# EAGLE design LED_I2C_Plug-Miller (EAGLE 9.6.2)
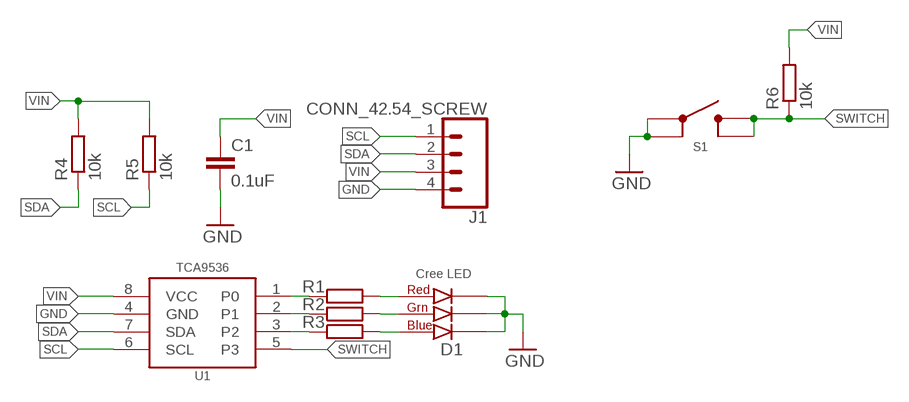
[diagram p0: schematic, sheet 1]

## Parts
C1  0.1uF  C-EU0.1UFC0603  [C0603]
D1  CLX6F-FKC  [CLX6F-FKC]
J1  CONN_42.54_SCREW  [1X04_SCREW]
R1  R-EU_330R0603  [R0603]
R2  R-EU_330R0603  [R0603]
R3  R-EU_330R0603  [R0603]
R4  10k  R-EU_10KR0603  [R0603]
R5  10k  R-EU_10KR0603  [R0603]
R6  10k  R-EU_10KR0603  [R0603]
S1  BUTTON4.2X3.2  [SWITCH_4.2X3.2]
U1  PCA9536VSSOP  [DGK_S-PDSO-G8]

## Nets
GND: C1.2 D1.P$1 D1.P$2 D1.P$3 J1.4 S1.1 S1.2 U1.4(GND)
N$1: D1.P$4 R1.2
N$2: D1.P$5 R2.2
N$3: D1.P$6 R3.2
N$4: R3.1 U1.3(P2)
N$5: R2.1 U1.2(P1)
N$6: R1.1 U1.1(P0)
SCL: J1.1 R5.1 U1.6(SCL)
SDA: J1.2 R4.1 U1.7(SDA)
SWITCH: R6.1 S1.3 S1.4 U1.5(P3)
VIN: C1.1 J1.3 R4.2 R5.2 R6.2 U1.8(VCC)

## Library data of the parts
C1 = bschulz_passives:C-EU: CAPACITOR, European symbol; DIGIKEY: 490-6051-1-ND; MF: Murata; MPN: GCM188R71E104KA57D
D1 = bschulz:CLX6F-FKC: Cree RBG LED, PLCC6 Package (Small Layout)
J1 = bschulz:CONN_4: Genaric 4 terminal header Digikey 2.54_SCREW <https://www.digikey.com/product-detail/en/on-shore-technology-inc/OSTVN04A150/ED10563-ND/1588864>; DIGIKEY: ED10563-ND; MF: On Shore; MPN: OSTVN04A150
R1-R3 = bschulz_passives:R-EU_: RESISTOR, European symbol Digikey Parts: Yageo, 0402 <https://www.digikey.com/products/en/resistors/chip-resistor-surface-mount/52?k=&pkeyword=&sv=0&s=4356&sf=1&FV=-1%7C13%2C7%7C2%2C1291%7C39157%2C1989%7C0%2C-8%7C52%2C3%7C1131%2C3%7C2503&quantity=&ColumnSort=0&page=1&stock=1&pageSize=25> Yageo, 0603 <https://www.digikey.com/products/en/resistors/chip-resistor-surface-mount/52?k=&pkeyword=&sv=0&pv1291=39245&sf=1&FV=-5%7C4356%2C-5%7C47360%2C-8%7C52%2C-1%7C13%2C7%7C2%2C1989%7C0&quantity=10&ColumnSort=1000011&page=1&stock=1&pageSize=25> Panasonic, 0603 <https://www.digikey.com/products/en/resistors/chip-resistor-surface-mount/52?k=&pkeyword=&pv252=68&sf=0&FV=ffec373d%2C1c0002%2C142c040c%2C1f140000%2Cffe00034%2C80002%2Cc0001&quantity=&ColumnSort=0&page=1&stock=1&pageSize=25> Panasonic, precision, 0603 <https://www.digikey.com/products/en/resistors/chip-resistor-surface-mount/52?FV=ffec4907%2Cfffc000a%2Cc0172%2C142c040c%2C1f140000%2Cffe00034%2C1c0002&quantity=100&ColumnSort=2085&page=1&stock=1&pageSize=25> Panasonic, 0805 <https://www.digikey.com/products/en/resistors/chip-resistor-surface-mount/52?k=&pkeyword=&pv3=1&sf=0&FV=ffec373d%2C1c0002%2C1f140000%2Cffe00034%2C142c040d&quantity=&ColumnSort=0&page=1&stock=1&pageSize=25> Rohm, current sense <https://www.digikey.com/products/en/resistors/chip-resistor-surface-mount/52?k=&pkeyword=&pv3=1&sf=0&FV=ffecb688%2C1f140000%2Cffe00034%2C1c0002&quantity=&ColumnSort=0&page=1&stock=1&pageSize=25> Vishay, pulse proof automotive <https://www.digikey.com/products/en/resistors/chip-resistor-surface-mount/52?k=&pkeyword=&pv7=2&sf=0&FV=ffec5d6b%2Cffe00034%2C1f140000&quantity=&ColumnSort=0&page=1&stock=1&pageSize=25>; DIGIKEY: 311-330HRCT-ND; MF: Yageo; MPN: RC0603FR-07330RL; VALUE_PART: 330
R4-R6 = bschulz_passives:R-EU_: RESISTOR, European symbol Digikey Parts: Yageo, 0402 <https://www.digikey.com/products/en/resistors/chip-resistor-surface-mount/52?k=&pkeyword=&sv=0&s=4356&sf=1&FV=-1%7C13%2C7%7C2%2C1291%7C39157%2C1989%7C0%2C-8%7C52%2C3%7C1131%2C3%7C2503&quantity=&ColumnSort=0&page=1&stock=1&pageSize=25> Yageo, 0603 <https://www.digikey.com/products/en/resistors/chip-resistor-surface-mount/52?k=&pkeyword=&sv=0&pv1291=39245&sf=1&FV=-5%7C4356%2C-5%7C47360%2C-8%7C52%2C-1%7C13%2C7%7C2%2C1989%7C0&quantity=10&ColumnSort=1000011&page=1&stock=1&pageSize=25> Panasonic, 0603 <https://www.digikey.com/products/en/resistors/chip-resistor-surface-mount/52?k=&pkeyword=&pv252=68&sf=0&FV=ffec373d%2C1c0002%2C142c040c%2C1f140000%2Cffe00034%2C80002%2Cc0001&quantity=&ColumnSort=0&page=1&stock=1&pageSize=25> Panasonic, precision, 0603 <https://www.digikey.com/products/en/resistors/chip-resistor-surface-mount/52?FV=ffec4907%2Cfffc000a%2Cc0172%2C142c040c%2C1f140000%2Cffe00034%2C1c0002&quantity=100&ColumnSort=2085&page=1&stock=1&pageSize=25> Panasonic, 0805 <https://www.digikey.com/products/en/resistors/chip-resistor-surface-mount/52?k=&pkeyword=&pv3=1&sf=0&FV=ffec373d%2C1c0002%2C1f140000%2Cffe00034%2C142c040d&quantity=&ColumnSort=0&page=1&stock=1&pageSize=25> Rohm, current sense <https://www.digikey.com/products/en/resistors/chip-resistor-surface-mount/52?k=&pkeyword=&pv3=1&sf=0&FV=ffecb688%2C1f140000%2Cffe00034%2C1c0002&quantity=&ColumnSort=0&page=1&stock=1&pageSize=25> Vishay, pulse proof automotive <https://www.digikey.com/products/en/resistors/chip-resistor-surface-mount/52?k=&pkeyword=&pv7=2&sf=0&FV=ffec5d6b%2Cffe00034%2C1f140000&quantity=&ColumnSort=0&page=1&stock=1&pageSize=25>; DIGIKEY: 311-10.0KHRCT-ND; MF: Yageo; MPN: RC0603FR-0710KL; VALUE_PART: 10k
S1 = bschulz:BUTTON: Genaric SPST Push button; DIGIKEY: CKN10504CT-ND; MF: C&K; MPN: PTS810 SJG 250 SMTR LFS
U1 = bschulz:PCA9536: PCA9536 - I2C I/O Expander, 4 bit, 5V tollerant Characteristics: Vcc: 2.3V ~ 5.5V IOut: >10mA IQ: 1μA Operating Temperature: -40°C to 85°C Internal Pullups Digikey: 296-20952-1-ND (DGK) <https://www.digikey.com/product-detail/en/texas-instruments/PCA9536DGKR/296-20952-1-ND/1216922>; DIGIKEY: 296-20952-1-ND; MF: TI; MPN: PCA9536DGKR

## Board
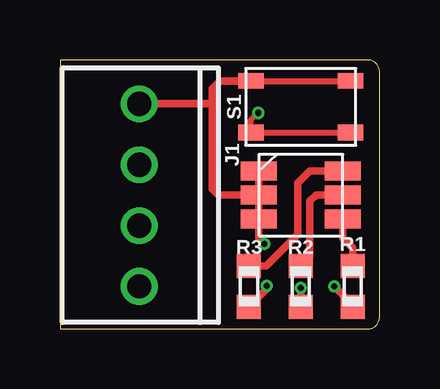
[diagram p1: board, top side]
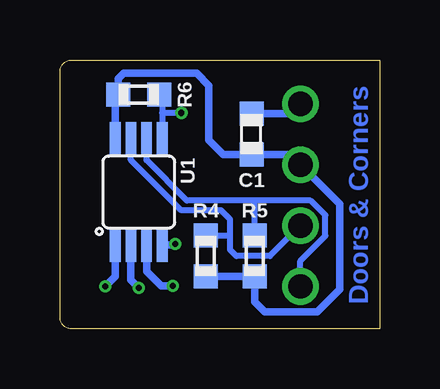
[diagram p2: board, bottom side, seen from below]

Size 13.32 x 11.23 mm. Coordinates in mm from the lower left corner, seen from the top.
Outline: 0,0 12.82,0 arc90 13.32,0.5 13.32,10.73 arc90 12.82,11.23 0,11.23 0,0
Copper layers (1*16): Top 0.035559375mm / dielectric 1.6mm / Bottom 0.035559375mm
Design rules "oshpark-2layer": minimum track width 6mil, minimum drill 10mil, track to track 6mil, track to pad 6mil, pad to pad 6mil, via to via 6mil, smd to smd 6mil, copper to edge 15mil, drill to drill 6mil, minimum pad ring 5mil, minimum via ring 5mil, stop-mask expansion 2.5mil, vias tented up to drill 0mil, thermal gap 10mil

### Footprints (pad centres in the part's own frame; a part is rotated, then mirrored left to right if it is on the bottom)
C0603 = smd 1 x 1: 1 -0.85,0; 2 0.85,0
CLX6F-FKC = smd 1.5 x 0.8: P$1 -1.75,1; P$2 -1.75,0; P$3 -1.75,-1; P$4 1.75,-1; P$5 1.75,0; P$6 1.75,1
1X04_SCREW = drill 1.016: 1 -3.81,0; 2 -1.27,0; 3 1.27,0; 4 3.81,0
R0603 = smd 1 x 1: 1 -0.85,0; 2 0.85,0
SWITCH_4.2X3.2 = smd 1.05 x 0.65: 1 -2.075,1.075; 2 2.075,1.075; 3 -2.075,-1.075; 4 2.075,-1.075
DGK_S-PDSO-G8 = smd 1.45 x 0.45: 1 -2.2,0.975; 2 -2.2,0.325; 3 -2.2,-0.325; 4 -2.2,-0.975; 5 2.2,-0.975; 6 2.2,-0.325; 7 2.2,0.325; 8 2.2,0.975

### Placement (x,y rotation side)
C1  5.33,8.13 90 bottom
D1  10.03,5.59 0 top
J1  3.3,5.59 90 top
R1  12.19,1.78 90 top
R2  10.03,1.78 90 top
R3  7.87,1.78 90 top
R4  7.24,3.05 270 bottom
R5  5.21,3.05 270 bottom
R6  10.03,9.78 180 bottom
S1  10.03,9.27 0 top
U1  10.03,5.71 90 bottom

### Tracks (layer width: path | path; a pad name or v marks a point on that pad's centre or on a via)
GND  (via drill 0.25)
  Top 0.254: S1.1 S1.2
  Top 0.305: D1.P$1 D1.P$2 | D1.P$2 D1.P$3 8.28,3.78 v8.51,3.56 | S1.1 6.66,10.35 6.35,10.03 6.35,9.4 | 6.35,9.4 6.35,5.84 6.6,5.59 D1.P$2 | J1.4 6.35,9.4
  Bottom 0.305: C1.2 3.72,8.98 J1.4 | U1.4 8.51,3.52 v8.51,3.56
N$1
  Top 0.305: R1.2 12.19,3.39 11.78,3.8 D1.P$4
N$2
  Top 0.305: R2.2 10.41,3.01 10.41,5.33 10.67,5.59 D1.P$5
N$3
  Top 0.305: 8.17,2.33 R3.2 8.6,2.63 9.91,3.94 9.91,6.1 10.4,6.59 D1.P$6 11.67,6.59
N$4  (via drill 0.25)
  Top 0.305: v8.62,1.8 8.62,1.67 R3.1
  Bottom 0.305: v8.62,1.8 9.1,1.8 9.71,2.4 U1.3
N$5  (via drill 0.25)
  Top 0.305: v10.03,1.72 R2.1
  Bottom 0.305: U1.2 10.36,2.05 v10.03,1.72
N$6  (via drill 0.25)
  Top 0.305: v11.43,1.78 12.19,1.02 R1.1
  Bottom 0.305: U1.1 11.01,2.2 v11.43,1.78
SCL
  Bottom 0.254: J1.1 3.3,2.85 2.26,3.89 2.26,4.75 2.87,5.36 5.21,5.36 | U1.6 9.71,7.04 8.03,5.36 5.21,5.36 | R5.1 5.21,5.36
SDA
  Bottom 0.254: J1.2 4.57,3.05 5.97,3.05 6.22,3.3 6.22,3.9 | U1.7 10.36,7.05 8.26,4.95 6.6,4.95 6.22,4.57 6.22,3.9 | R4.1 6.22,3.9
SWITCH  (via drill 0.25)
  Top 0.254: S1.4 S1.3 7.96,8.72 v8.25,9.02
  Bottom 0.254: R6.1 9.06,9.65 9.06,9.02 | 9.06,9.02 U1.5 | v8.25,9.02 9.06,9.02
VIN
  Bottom 0.305: U1.8 11.01,9.65 R6.2 10.88,10.45 10.67,10.67 7.62,10.67 7.11,10.16 7.11,7.87 6.52,7.28 C1.1 3.72,7.28 J1.3 1.65,5.21 1.65,1.65 2.59,0.71 4.78,0.71 5.21,1.14 R5.2 R4.2

### Text on the board
Bottom: Doors & Corners
tDocu: GND | VCC | SDA | SCL
bDocu: GND | VCC | Ext Ctrl Mod (Miller) | SDA | SCL | B. Schulz